# Altium schematic sheet Server UART & JTAG.schdoc
size 515 x 282 mm
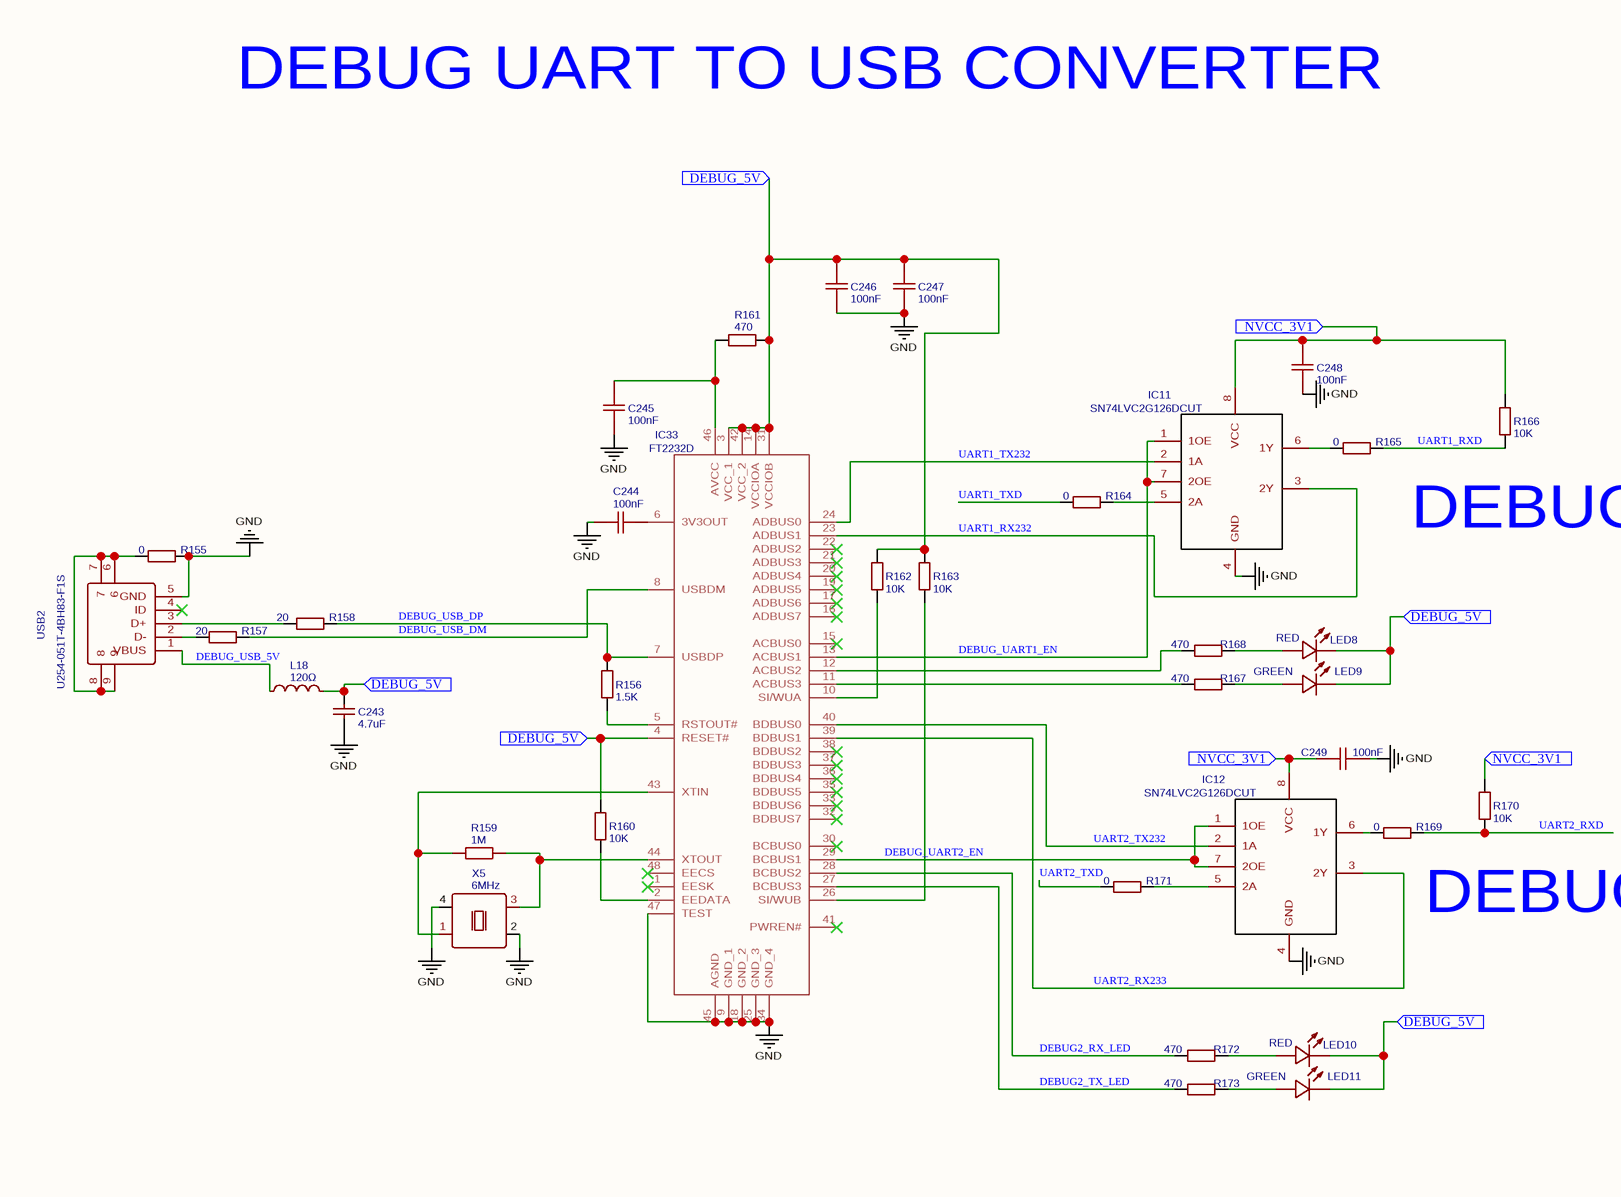
[diagram p0: Server UART & JTAG.schdoc, left]
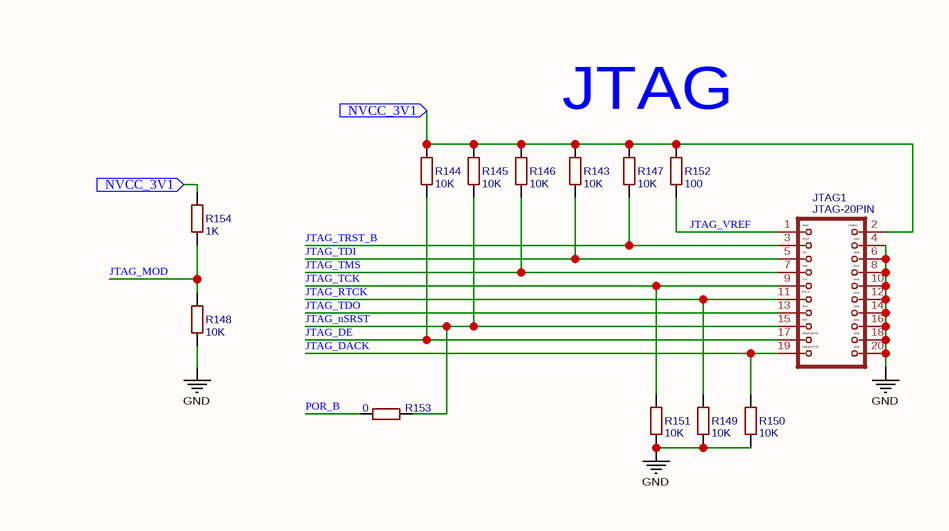
[diagram p1: Server UART & JTAG.schdoc, right]

## Parts
C243  4.7uF  [C0603]
C244  100nF  [C0603]
C245  100nF  [C0603]
C246  100nF  [C0603]
C247  100nF  [C0603]
C248  100nF  [C0603]
C249  100nF  [C0603]
IC11  SN74LVC2G126DCUT  [SOP50P310X90-8N]
IC12  SN74LVC2G126DCUT  [SOP50P310X90-8N]
IC33  FT2232D  [QFP50P900X900X160-48N]
JTAG1  JTAG-20PIN  [2X10_2.54MM_PTH]
L18  120Ω  [L0402]
LED8  RED  [LED0402-R-RD]
LED9  GREEN  [LED0402-R-RD]
LED10  RED  [LED0402-R-RD]
LED11  GREEN  [LED0402-R-RD]
R143  10K  [R0402]
R144  10K  [R0402]
R145  10K  [R0402]
R146  10K  [R0402]
R147  10K  [R0402]
R148  10K  [R0402]
R149  10K  [R0402]
R150  10K  [R0402]
R151  10K  [R0402]
R152  100  [R0402]
R153  0  [R0402]
R154  1K  [R0402]
R155  0  [R0402]
R156  1.5K  [R0402]
R157  20  [R0805]
R158  20  [R0805]
R159  1M  [R0603]
R160  10K  [R0402]
R161  470  [R0402]
R162  10K  [R0402]
R163  10K  [R0402]
R164  0  [R0402]
R165  0  [R0402]
R166  10K  [R0402]
R167  470  [R0402]
R168  470  [R0402]
R169  0  [R0402]
R170  10K  [R0402]
R171  0  [R0402]
R172  470  [R0402]
R173  470  [R0402]
USB2  U254-051T-4BH83-F1S  [MICRO-USB-SMD_U254-051T-4BH83-F1S]
X5  6MHz  [OSC-SMD_4P-L5.0-W3.2-BL]

## Ports
DEBUG_5V (in), NVCC_3V1 (in)

## Nets
GND: C243.1 C244.2 C245.2 C246.2 C247.2 C248.2 C249.2 IC11.4(GND) IC12.4(GND) IC33.9(GND_1) IC33.18(GND_2) IC33.25(GND_3) IC33.34(GND_4) IC33.45(AGND) IC33.47(TEST) JTAG1.4 JTAG1.6 JTAG1.8 JTAG1.10 JTAG1.12 JTAG1.14 JTAG1.16 JTAG1.18 JTAG1.20 R148.1 R149.1 R150.1 R151.1 R155.2 USB2.5(GND) X5.2(GND) X5.4(VCC)
DEBUG2_RX_LED: IC33.28(BCBUS2) R172.1
DEBUG2_TX_LED: IC33.27(BCBUS3) R173.1
DEBUG_5V: C243.2 C246.1 C247.1 IC33.3(VCC_1) IC33.4(RESET#) IC33.14(VCCIOA) IC33.31(VCCIOB) IC33.42(VCC_2) L18.2 LED8.2(K) LED9.2(K) LED10.2(K) LED11.2(K) R160.2 R161.2 R162.2 R163.2 ; port DEBUG_5V
DEBUG_UART1_EN: IC11.1(1OE) IC11.7(2OE) IC33.13(ACBUS1)
DEBUG_UART2_EN: IC12.1(1OE) IC12.7(2OE) IC33.29(BCBUS1)
DEBUG_USB_5V: L18.1 USB2.1(VBUS)
DEBUG_USB_DM: IC33.8(USBDM) R157.2
DEBUG_USB_DP: IC33.7(USBDP) R156.2 R158.2
JTAG_DACK: JTAG1.19 R150.2
JTAG_DE: JTAG1.17 R144.1
JTAG_MOD: R148.2 R154.1
JTAG_nSRST: JTAG1.15 R145.1 R153.2
JTAG_RTCK: JTAG1.11 R149.2
JTAG_TCK: JTAG1.9 R151.2
JTAG_TDI: JTAG1.5 R143.1
JTAG_TDO: JTAG1.13
JTAG_TMS: JTAG1.7 R146.1
JTAG_TRST_B: JTAG1.3 R147.1
JTAG_VREF: JTAG1.1 R152.1
NVCC_3V1: C248.1 C249.1 IC11.8(VCC) IC12.8(VCC) JTAG1.2 R143.2 R144.2 R145.2 R146.2 R147.2 R152.2 R154.2 R166.2 R170.2 ; port NVCC_3V1
POR_B: R153.1
UART1_RX232: IC11.3(2Y) IC33.23(ADBUS1)
UART1_RXD: R165.2 R166.1
UART1_TX232: IC11.2(1A) IC33.24(ADBUS0)
UART1_TXD: R164.1
UART2_RX233: IC12.3(2Y) IC33.39(BDBUS1)
UART2_RXD: R169.2 R170.1
UART2_TX232: IC12.2(1A) IC33.40(BDBUS0)
UART2_TXD: R171.1
NetC244_1: C244.1 IC33.6(3V3OUT)
NetC245_1: C245.1 IC33.46(AVCC) R161.1
NetIC11_5: IC11.5(2A) R164.2
NetIC11_6: IC11.6(1Y) R165.1
NetIC12_5: IC12.5(2A) R171.2
NetIC12_6: IC12.6(1Y) R169.1
NetIC33_2: IC33.2(EEDATA) R160.1
NetIC33_5: IC33.5(RSTOUT#) R156.1
NetIC33_10: IC33.10(SI/WUA) R162.1
NetIC33_11: IC33.11(ACBUS3) R167.1
NetIC33_12: IC33.12(ACBUS2) R168.1
NetIC33_26: IC33.26(SI/WUB) R163.1
NetIC33_43: IC33.43(XTIN) R159.1 X5.1(tri)
NetIC33_44: IC33.44(XTOUT) R159.2 X5.3(OUT)
NetLED8_1: LED8.1(A) R168.2
NetLED9_1: LED9.1(A) R167.2
NetLED10_1: LED10.1(A) R172.2
NetLED11_1: LED11.1(A) R173.2
NetR155_1: R155.1 USB2.6 USB2.7 USB2.8 USB2.9
NetR157_1: R157.1 USB2.2(D-)
NetR158_1: R158.1 USB2.3(D+)

Not connected (* = marked no-connect by the designer): IC33 1(EESK)* 15(ACBUS0)* 16(ADBUS7)* 17(ADBUS6)* 19(ADBUS5)* 20(ADBUS4)* 21(ADBUS3)* 22(ADBUS2)* 30(BCBUS0)* 32(BDBUS7)* 33(BDBUS6)* 35(BDBUS5)* 36(BDBUS4)* 37(BDBUS3)* 38(BDBUS2)* 41(PWREN#)* 48(EECS)*; USB2 4(ID)*

## Notes on the sheet
- DEBUG UART TO USB CONVERTER
- DEBUG UART FOR A9
- DEBUG UART FOR M4
- JTAG
- (in symbol JTAG-20PIN) VREF; VTARG; !TRST; GND; TDI; TMS; TCK; RTCK; TDO; RST; DBGRQRXD; DBGACKTXD

## Library data of the parts
C243 = 4.7uF: BOM_Manufacturer Part: CL10A475KO8NNNC; BOM_Manufacturer: SAMSUNG; nameAlias: Capacitance; SMT Type: Basic; BOM_Supplier: LCSC; BOM_LCSC Assembly: Yes; BOM_Supplier Part: C19666; spicePre: C; spiceSymbolName: CL10A475KO8NNNC
C244-C249 = 100nF: BOM_Manufacturer: YAGEO; BOM_Manufacturer Part: CC0603KRX7R9BB104; nameAlias: Capacitance; SMT Type: Basic; BOM_Supplier: LCSC; BOM_LCSC Assembly: Yes; BOM_Supplier Part: C14663; spicePre: C; spiceSymbolName: CC0603KRX7R9BB104
IC11 IC12 = SN74LVC2G126DCUT: Contributor: Ke'Ondrae_Mell; spicePre: I; spiceSymbolName: SN74LVC2G126DCUT
IC33 = FT2232D: Contributor: Ke'Ondrae_Mell; spicePre: I; spiceSymbolName: FT2232D
JTAG1 = JTAG-20PIN: description: JTAG 20 Pin Programming Connector; Contributor: PatternAgents; spicePre: J; spiceSymbolName: JTAG-20PIN
L18 = 120Ω: BOM_Manufacturer: TDK; BOM_Manufacturer Part: MMZ1005F121ET000; nameAlias: Value; SMT Type: Extend; BOM_Supplier: LCSC; BOM_Supplier Part: C89458; BOM_LCSC Assembly: Yes; spicePre: L; spiceSymbolName: MMZ1005F121ET000
LED8 LED10 = RED: BOM_Manufacturer: EVERLIGHT; BOM_Manufacturer Part: 16-213UYOC/S530-A2/TR8; SMT Type: Extend; BOM_Supplier: LCSC; BOM_Supplier Part: C88330; BOM_LCSC Assembly: Yes; spicePre: L; spiceSymbolName: 16-213UYOC/S530-A2/TR8
LED9 LED11 = GREEN: BOM_Manufacturer: EVERLIGHT; BOM_Manufacturer Part: 16-213UYOC/S530-A2/TR8; SMT Type: Extend; BOM_Supplier: LCSC; BOM_Supplier Part: C88330; BOM_LCSC Assembly: Yes; spicePre: L; spiceSymbolName: 16-213UYOC/S530-A2/TR8
R143-R151 R160 R162 R163 R166 R170 = 10K: BOM_Manufacturer: UniOhm; BOM_Manufacturer Part: 0402WGF1002TCE; nameAlias: Resistance (Ohms); SMT Type: Basic; BOM_Supplier: LCSC; BOM_LCSC Assembly: Yes; BOM_Supplier Part: C25744; spicePre: R; spiceSymbolName: 0402WGF1002TCE
R152 = 100: BOM_Manufacturer: UniOhm; BOM_Manufacturer Part: TC0225F1000TCE; nameAlias: Resistance (Ohms); SMT Type: Extend; BOM_Supplier: LCSC; BOM_Supplier Part: C98836; BOM_LCSC Assembly: Yes; spicePre: R; spiceSymbolName: TC0225F1000TCE
R153 R155 R164 R165 R169 R171 = 0: BOM_Manufacturer: KOA; BOM_Manufacturer Part: RK73Z1ETTP; nameAlias: Resistance (Ohms); BOM_Supplier: LCSC; BOM_Supplier Part: C131359; spicePre: R; spiceSymbolName: RK73Z1ETTP
R154 = 1K: BOM_Manufacturer: UniOhm; BOM_Manufacturer Part: TC0225F1001TCE; nameAlias: Resistance (Ohms); SMT Type: Extend; BOM_Supplier: LCSC; BOM_Supplier Part: C98841; BOM_LCSC Assembly: Yes; spicePre: R; spiceSymbolName: TC0225F1001TCE
R156 = 1.5K: BOM_Manufacturer: UniOhm; BOM_Manufacturer Part: 0402WGF1501TCE; nameAlias: Resistance (Ohms); SMT Type: Basic; BOM_Supplier: LCSC; BOM_LCSC Assembly: Yes; BOM_Supplier Part: C25867; spicePre: R; spiceSymbolName: 0402WGF1501TCE
R157 R158 = 20: BOM_Manufacturer: UniOhm; BOM_Manufacturer Part: 0805W8F200JT5E; nameAlias: Resistance (Ohms); SMT Type: Basic; BOM_Supplier: LCSC; BOM_LCSC Assembly: Yes; BOM_Supplier Part: C17544; spicePre: R; spiceSymbolName: 0805W8F200JT5E
R159 = 1M: BOM_Manufacturer: Tyohm; BOM_Manufacturer Part: RMC06031M1%N; nameAlias: Resistance (Ohms); Contributor: LCSC; BOM_Supplier: LCSC; BOM_Supplier Part: C269705; spicePre: R; spiceSymbolName: RMC06031M1%N
R161 R167 R168 R172 R173 = 470: BOM_Manufacturer: UniOhm; BOM_Manufacturer Part: 0402WGF4700TCE; nameAlias: Resistance (Ohms); SMT Type: Basic; BOM_Supplier: LCSC; BOM_LCSC Assembly: Yes; BOM_Supplier Part: C25117; spicePre: R; spiceSymbolName: 0402WGF4700TCE
USB2 = U254-051T-4BH83-F1S: BOM_Manufacturer: XKB Enterprise; Contributor: LCSC; BOM_Supplier: LCSC; BOM_Supplier Part: C397452; BOM_Manufacturer Part: U254-051T-4BH83-F1S; spicePre: U; spiceSymbolName: U254-051T-4BH83-F1S
X5 = 6MHz: BOM_Manufacturer: TAITIEN Elec; BOM_Manufacturer Part: OVETGLJANF-6MHZ; nameAlias: Frequency; Contributor: LCSC; SMT Type: Extend; BOM_Supplier: LCSC; BOM_Supplier Part: C295516; BOM_LCSC Assembly: Yes; spicePre: X; spiceSymbolName: OVETGLJANF-6MHZ